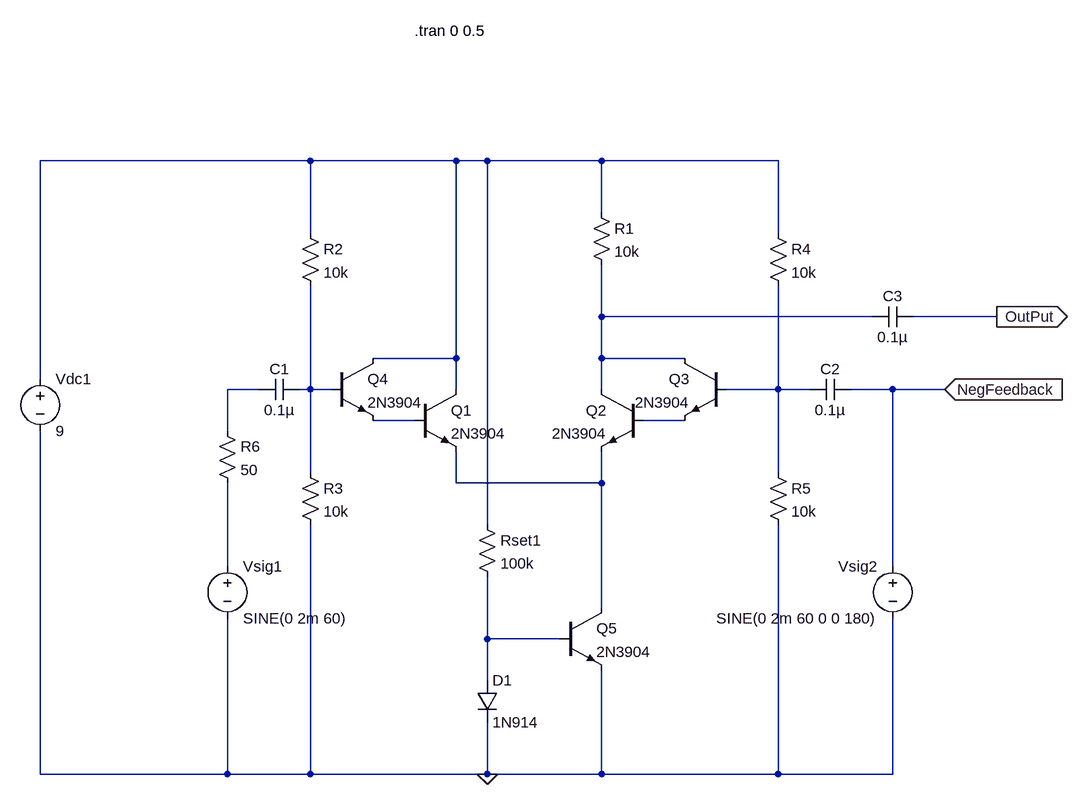
[diagram p0: schematic DiffAmpWithCurrentSource.asc]
DiffAmpWithCurrentSource.asc, the LTspice schematic file:
Version 4
SHEET 1 1516 976
WIRE 336 16 -80 16
WIRE 560 16 336 16
WIRE 608 16 560 16
WIRE 784 16 608 16
WIRE 1056 16 784 16
WIRE 784 96 784 16
WIRE 336 128 336 16
WIRE 1056 128 1056 16
WIRE 784 256 784 176
WIRE 1200 256 784 256
WIRE 1392 256 1264 256
WIRE 560 320 560 16
WIRE 560 320 432 320
WIRE 784 320 784 256
WIRE 912 320 784 320
WIRE -80 352 -80 16
WIRE 256 368 208 368
WIRE 336 368 336 208
WIRE 336 368 320 368
WIRE 368 368 336 368
WIRE 560 368 560 320
WIRE 784 368 784 320
WIRE 1056 368 1056 208
WIRE 1056 368 976 368
WIRE 1104 368 1056 368
WIRE 1232 368 1168 368
WIRE 1312 368 1232 368
WIRE 496 416 432 416
WIRE 912 416 848 416
WIRE 208 432 208 368
WIRE 336 496 336 368
WIRE 1056 496 1056 368
WIRE 560 512 560 464
WIRE 784 512 784 464
WIRE 784 512 560 512
WIRE 608 576 608 16
WIRE 208 640 208 512
WIRE 1232 640 1232 368
WIRE 784 704 784 512
WIRE 608 752 608 656
WIRE 720 752 608 752
WIRE 608 816 608 752
WIRE -80 960 -80 432
WIRE 208 960 208 720
WIRE 208 960 -80 960
WIRE 336 960 336 576
WIRE 336 960 208 960
WIRE 608 960 608 880
WIRE 608 960 336 960
WIRE 784 960 784 800
WIRE 784 960 608 960
WIRE 1056 960 1056 576
WIRE 1056 960 784 960
WIRE 1232 960 1232 720
WIRE 1232 960 1056 960
FLAG 1392 256 OutPut
IOPIN 1392 256 Out
FLAG 1312 368 NegFeedback
IOPIN 1312 368 In
FLAG 608 960 0
SYMBOL npn 496 368 R0
SYMATTR InstName Q1
SYMATTR Value 2N3904
SYMBOL npn 848 368 M0
SYMATTR InstName Q2
SYMATTR Value 2N3904
SYMBOL npn 976 320 M0
SYMATTR InstName Q3
SYMATTR Value 2N3904
SYMBOL npn 368 320 R0
SYMATTR InstName Q4
SYMATTR Value 2N3904
SYMBOL res 768 80 R0
SYMATTR InstName R1
SYMATTR Value 10k
SYMBOL voltage -80 336 R0
SYMATTR InstName Vdc1
SYMATTR Value 9
SYMBOL cap 320 352 R90
WINDOW 0 0 32 VBottom 2
WINDOW 3 32 32 VTop 2
SYMATTR InstName C1
SYMATTR Value 0.1µ
SYMBOL voltage 208 624 R0
SYMATTR InstName Vsig1
SYMATTR Value SINE(0 2m 60)
SYMBOL res 320 112 R0
SYMATTR InstName R2
SYMATTR Value 10k
SYMBOL res 320 480 R0
SYMATTR InstName R3
SYMATTR Value 10k
SYMBOL voltage 1232 624 M0
SYMATTR InstName Vsig2
SYMATTR Value SINE(0 2m 60 0 0 180)
SYMBOL cap 1168 352 R90
WINDOW 0 0 32 VBottom 2
WINDOW 3 32 32 VTop 2
SYMATTR InstName C2
SYMATTR Value 0.1µ
SYMBOL res 1040 112 R0
SYMATTR InstName R4
SYMATTR Value 10k
SYMBOL res 1040 480 R0
SYMATTR InstName R5
SYMATTR Value 10k
SYMBOL res 192 416 R0
SYMATTR InstName R6
SYMATTR Value 50
SYMBOL cap 1264 240 R90
WINDOW 0 0 32 VBottom 2
WINDOW 3 32 32 VTop 2
SYMATTR InstName C3
SYMATTR Value 0.1µ
SYMBOL npn 720 704 R0
SYMATTR InstName Q5
SYMATTR Value 2N3904
SYMBOL diode 592 816 R0
SYMATTR InstName D1
SYMATTR Value 1N914
SYMBOL res 592 560 R0
SYMATTR InstName Rset1
SYMATTR Value 100k
TEXT 496 -184 Left 2 !.tran 0 0.5

The netlist it stands for:
* DiffAmpWithCurrentSource.asc
Q1 N001 N006 N008 0 2N3904
Q2 N002 N007 N008 0 2N3904
Q3 N002 N005 N007 0 2N3904
Q4 N001 N004 N006 0 2N3904
R1 N001 N002 10k
Vdc1 N001 0 9
C1 N004 N003 0.1µ
Vsig1 N009 0 SINE(0 2m 60)
R2 N001 N004 10k
R3 N004 0 10k
Vsig2 NegFeedback 0 SINE(0 2m 60 0 0 180)
C2 NegFeedback N005 0.1µ
R4 N001 N005 10k
R5 N005 0 10k
R6 N003 N009 50
C3 OutPut N002 0.1µ
Q5 N008 N010 0 0 2N3904
D1 N010 0 1N914
Rset1 N001 N010 100k
.model D D
.lib standard.dio
.model NPN NPN
.model PNP PNP
.lib standard.bjt
.tran 0 0.5
.backanno
.end